# EAGLE design Franzininho_CNC (EAGLE 7.5.0)
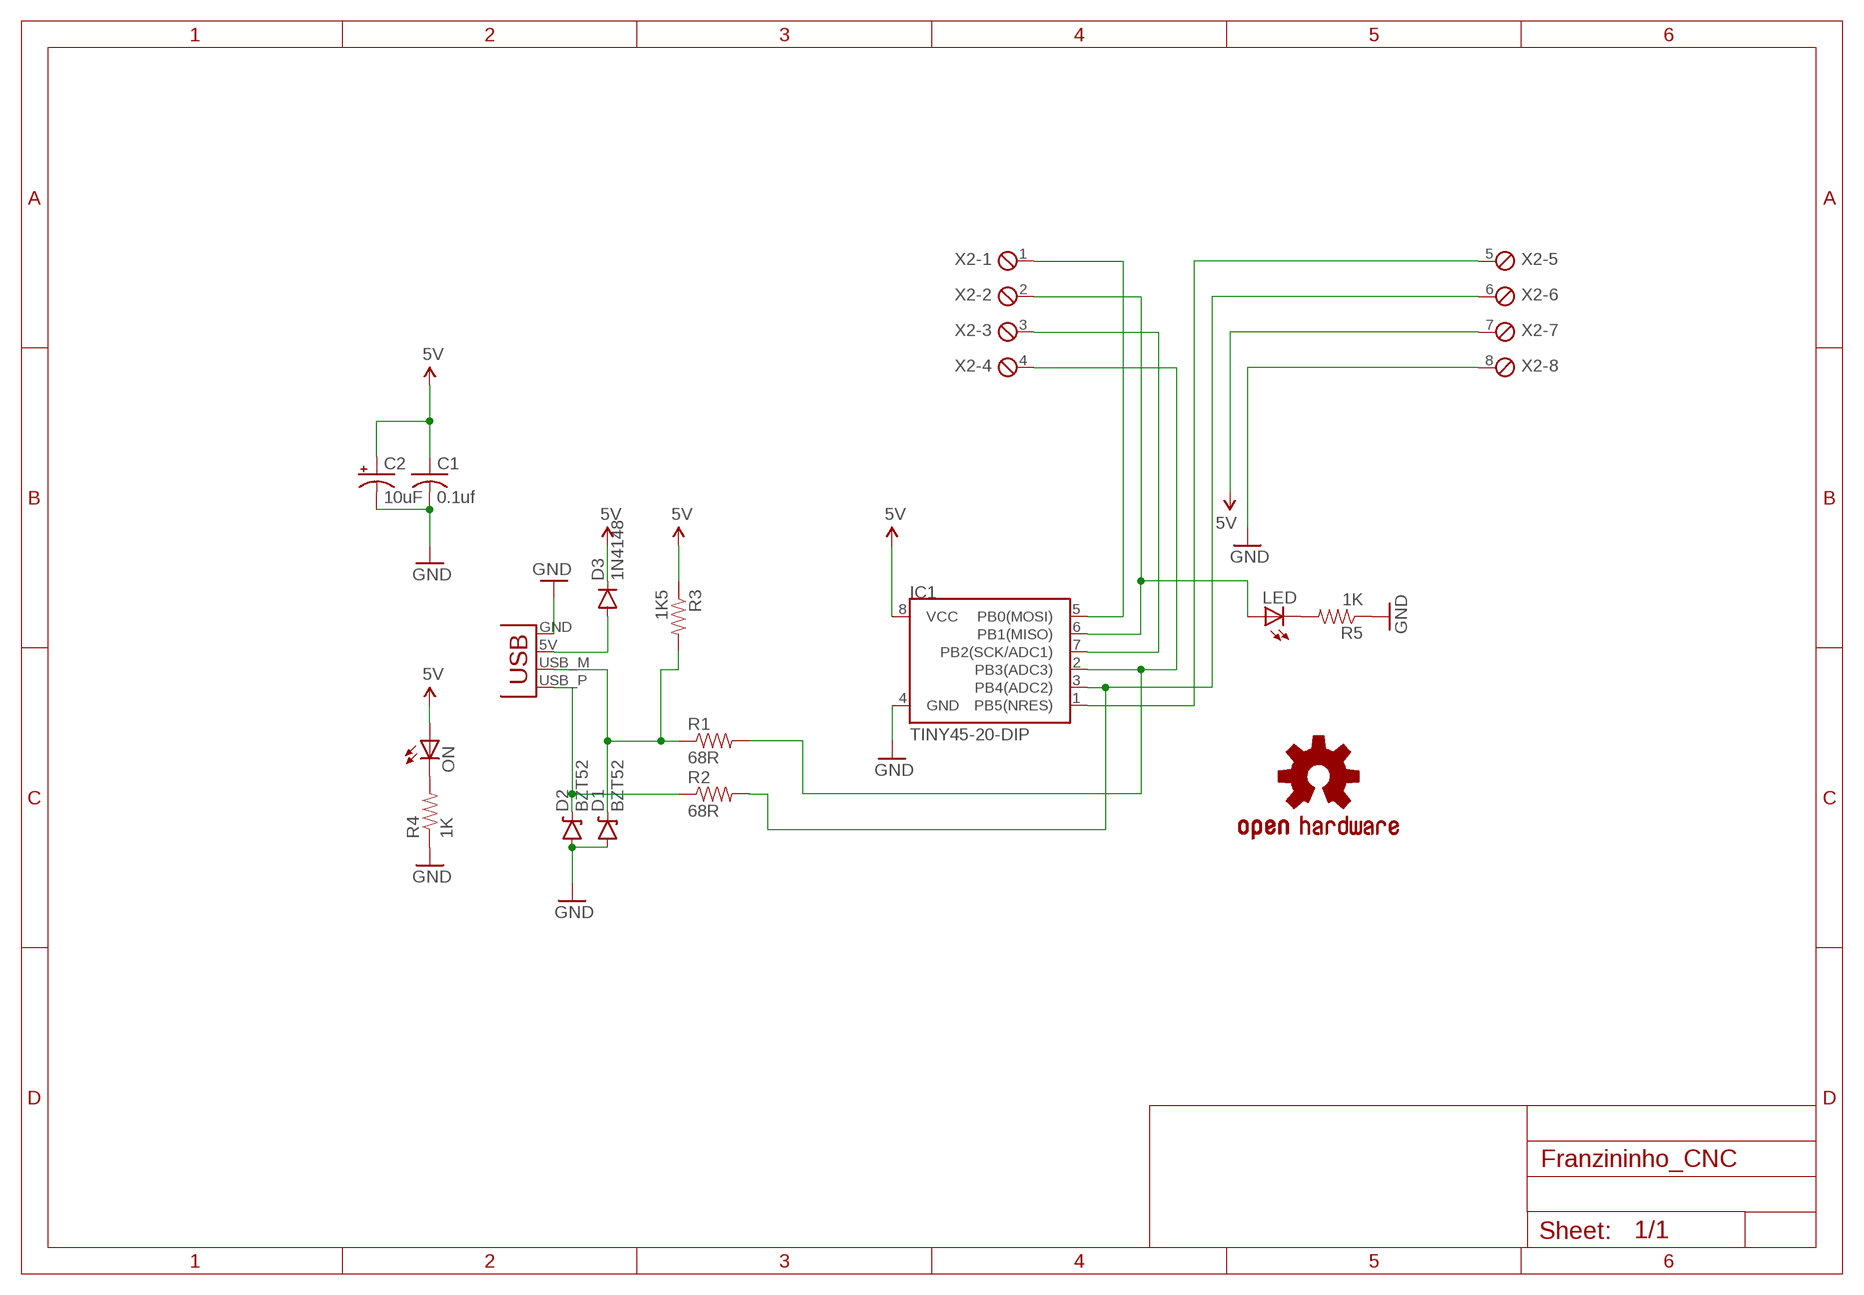
[diagram p0: schematic, sheet 1]

## Parts
C1  0.1uf  C-US025-025X050  [C025-025X050]
C2  10uF  CPOL-USE2,5-6E  [E2,5-6E]
D1  BZT52  DIODE-ZENER  [DIODE-BZT52]
D2  BZT52  DIODE-ZENER  [DIODE-BZT52]
D3  1N4148  DIODE1N4148  [DIODE-1N4148]
IC1  TINY45-20-DIP  ATTINY45TINY45-20-DIP  [DIP08]
LED  LED3MM  [LED3MM]
LOGO1  OSHW-LOGOL  [OSHW-LOGO-L]
ON  LED3MM  [LED3MM]
R1  68R  RESISTORPTH-1/4W  [AXIAL-0.4]
R2  68R  RESISTORPTH-1/4W  [AXIAL-0.4]
R3  1K5  RESISTORPTH-1/4W  [AXIAL-0.4]
R4  1K  RESISTORPTH-1/4W  [AXIAL-0.4]
R5  1K  RESISTORPTH-1/4W  [AXIAL-0.4]
X1  USBPCB  [USB-A-PCB]
X2  MPT8  [8POL254]

## Nets
5V: C1.1 C2.+ D3.C IC1.8(VCC) ON.A R3.P$1 X2.7
GND: C1.2 C2.- D1.A D2.A IC1.4(GND) R4.P$1 R5.P$1 X1.GND X2.8
N$1: IC1.2(PB3(ADC3)) R1.P$2 X2.4
N$2: IC1.6(PB1(MISO)) LED.A X2.2
N$3: IC1.5(PB0(MOSI)) X2.1
N$4: D3.A X1.5V(VBUS)
N$5: IC1.7(PB2(SCK/ADC1)) X2.3
N$6: IC1.3(PB4(ADC2)) R2.P$2 X2.6
N$8: IC1.1(PB5(NRES)) X2.5
N$10: D1.C R1.P$1 R3.P$2 X1.USB_M(D-)
N$11: D2.C R2.P$1 X1.USB_P(D+)
N$12: LED.K(C) R5.P$2
N$17: ON.K(C) R4.P$2

## Library data of the parts
C1 = adafruit:C-US: CAPACITOR, American symbol
C2 = adafruit:CPOL-US: POLARIZED CAPACITOR, American symbol
D1 D2 = SparkFun-DiscreteSemi:DIODE-ZENER: Zener Diode Production Part - 8199 3.4V Zener Voltage; PROD-ID: DIO-08199
D3 = SparkFun-DiscreteSemi:DIODE: Diode These are standard reverse protection diodes and small signal diodes. SMA package can handle up to about 1A. SOD-323 can handle about 200mA. What the SOD-323 package when ordering, there are some mfgs out there that are 5-pin packages.; PROD_ID: DIO-08378
IC1 = SparkFun-DigitalIC:ATTINY45: Atmel 8-pin 2/4/8kB flash uC; PROD_ID: IC-09439
LED ON = adafruit:LED: LED OSRAM: - CHIPLED LG R971, LG N971, LY N971, LG Q971, LY Q971, LO R971, LY R971 LH N974, LH R974 LS Q976, LO Q976, LY Q976 LO Q996 - Hyper CHIPLED LW Q18S LB Q993, LB Q99A, LB R99A - SideLED LS A670, LO A670, LY A670, LG A670, LP A670 LB A673, LV A673, LT A673, LW A673 LH A674 LY A675 LS A676, LA A676, LO A676, LY A676, LW A676 LS A679, LY A679, LG A679 - Hyper Micro SIDELED® LS Y876, LA Y876, LO Y876, LY Y876 LT Y87S - SmartLED LW L88C, LW L88S LB L89C, LB L89S, LG L890 LS L89K, LO L89K, LY L89K LS L896, LA L896, LO L896, LY L896 - TOPLED LS T670, LO T670, LY T670, LG T670, LP T670 LSG T670, LSP T670, LSY T670, LOP T670, LYG T670 LG T671, LOG T671, LSG T671 LB T673, LV T673, LT T673, LW T673 LH T674 LS T676, LA T676, LO T676, LY T676, LB T676, LH T676, LSB T676, LW T676 LB T67C, LV T67C, LT T67C, LS T67K, LO T67K, LY T67K, LW E67C LS E67B, LA E67B, LO E67B, LY E67B, LB E67C, LV E67C, LT E67C LW T67C LS T679, LY T679, LG T679 LS T770, LO T770, LY T770, LG T770, LP T770 LB T773, LV T773, LT T773, LW T773 LH T774 LS E675, LA E675, LY E675, LS T675 LS T776, LA T776, LO T776, LY T776, LB T776 LHGB T686 LT T68C, LB T68C - Hyper Mini TOPLED® LB M676 - Mini TOPLED Santana® LG M470 LS M47K, LO M47K, LY M47K Source: http://www.osram.convergy.de/
LOGO1 = SparkFun-Aesthetics:OSHW-LOGO: Open Source Hardware Logo This logo indicates the piece of hardware it is found on incorporates a OSHW license and/or adheres to the definition of open source hardware found here: http://freedomdefined.org/OSHW
R1-R5 = SparkFun-Passives:RESISTOR: Resistor Basic schematic elements and footprints for 0603, 1206, and PTH resistors.
X1 = SparkFun:USB: USB Connectors USB-B-PTH is fully proven SKU : PRT-00139 USB-miniB is fully proven SKU : PRT-00587 USB-A-PCB is untested. USB-A-H is throughly reviewed, but untested. Spark Fun Electronics SKU : PRT-00437 USB-B-SMT is throughly reviewed, but untested. Needs silkscreen touching up. USB-A-S has not been used/tested USB-MB-H has not been used/tested
X2 = con-phoenix-254:MPT8: PHOENIX CONNECTOR; OC_FARNELL: unknown; OC_NEWARK: unknown

## Board
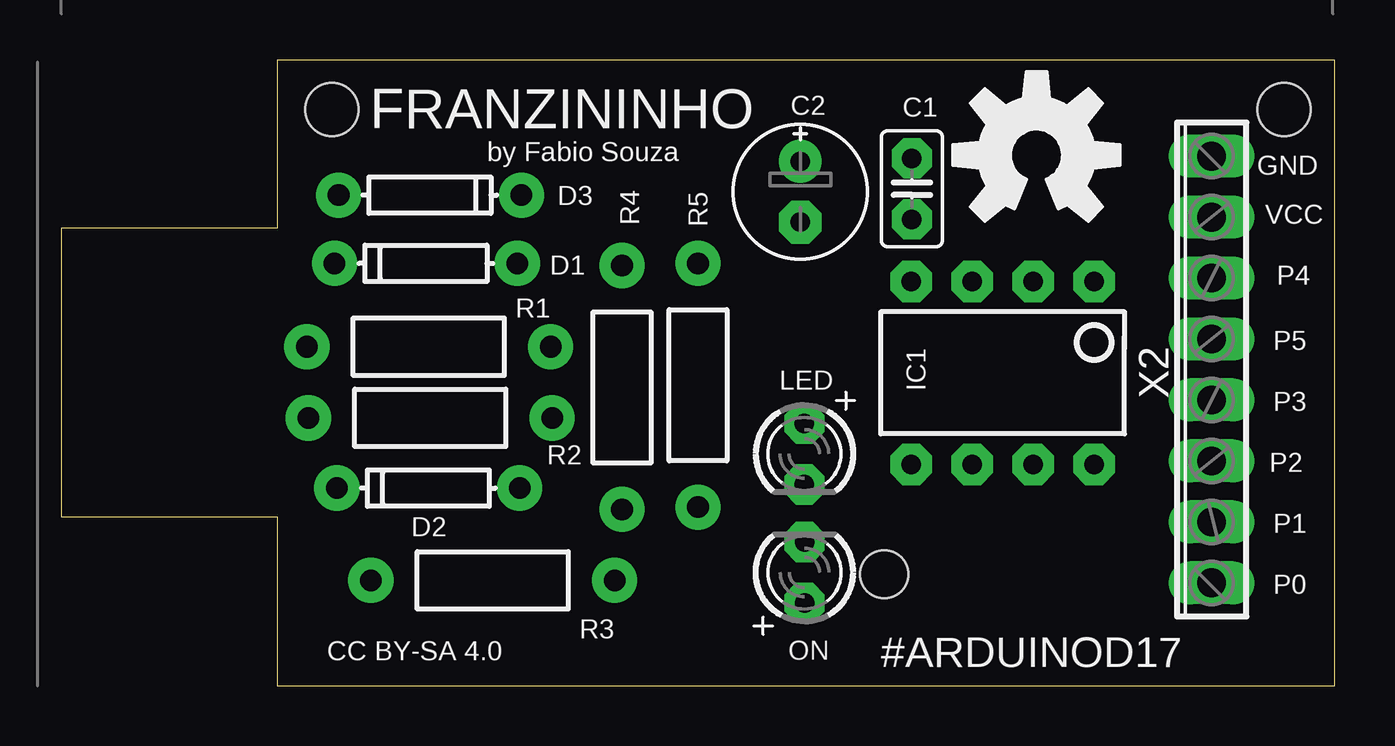
[diagram p1: board, top side]
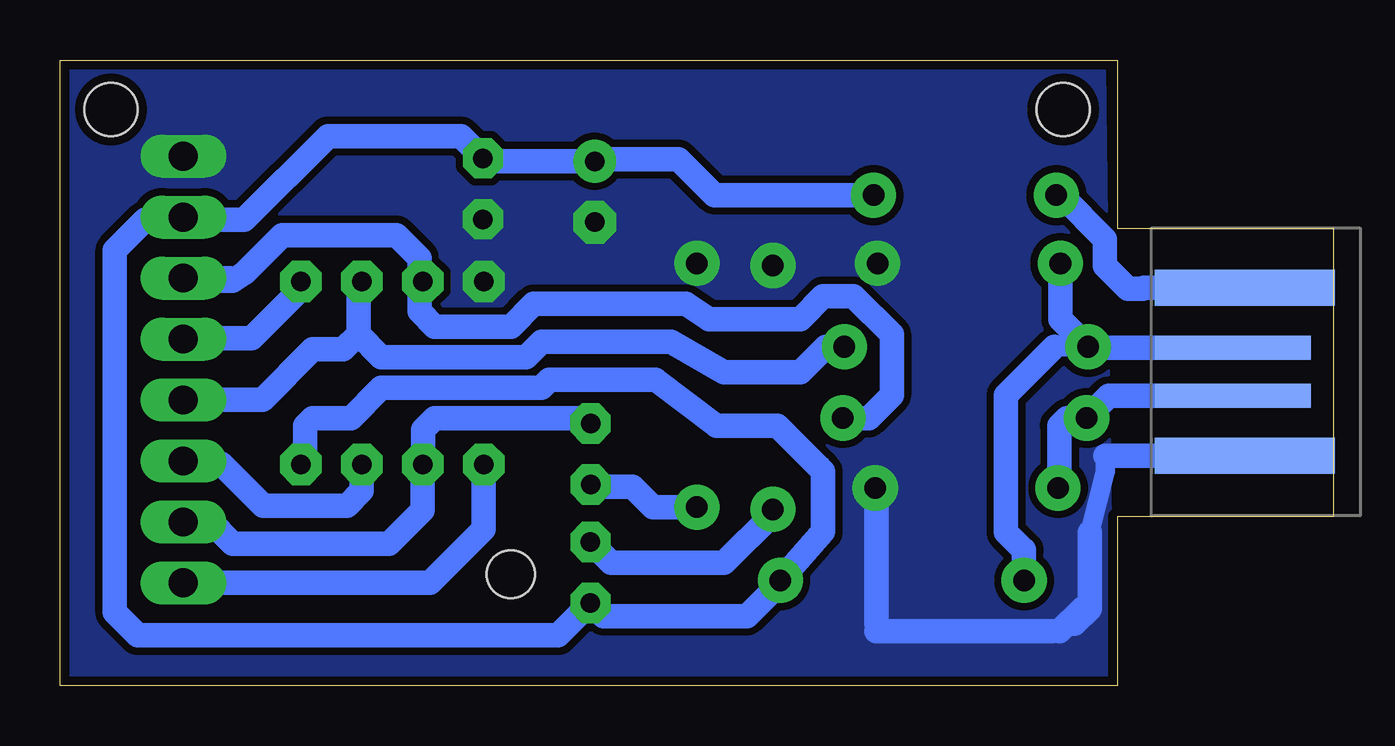
[diagram p2: board, bottom side, seen from below]

Size 53.08 x 26.08 mm. Coordinates in mm from the lower left corner, seen from the top.
Outline: 0,7.04 9,7.04 9,0 53.08,0 53.08,26.08 9,26.08 9,19.07 0,19.07 0,7.04
Copper layers (1*16): Top 0.0356mm / dielectric 1.5011mm / Bottom 0.0356mm
Design rules "default *": minimum track width 8mil, minimum drill 13mil, track to track 12mil, track to pad 12mil, pad to pad 12mil, via to via 12mil, smd to smd 8mil, copper to edge 15mil, drill to drill 15mil, minimum pad ring 7mil, minimum via ring 7mil, stop-mask expansion 4mil, vias tented up to drill 25mil, thermal gap 10mil
Holes 2.2 mm at 11.27,24.02 50.96,24.02
Holes 2 mm at 34.29,4.65

### Footprints (pad centres in the part's own frame; a part is rotated, then mirrored left to right if it is on the bottom)
C025-025X050 = drill 0.813 pad 1.676 octagon: 1 -1.27,0; 2 1.27,0
E2,5-6E = drill 0.813 pad 1.778: + -1.27,0 | drill 0.813 pad 1.778 octagon: - 1.27,0
DIODE-BZT52 = drill 0.9 pad 1.88: A -3.81,0; C 3.81,0
DIODE-1N4148 = drill 0.9 pad 1.88: A -3.81,0; C 3.81,0
DIP08 = drill 0.813 pad 1.727 octagon: 1 -3.81,-3.81; 2 -1.27,-3.81; 3 1.27,-3.81; 4 3.81,-3.81; 5 3.81,3.81; 6 1.27,3.81; 7 -1.27,3.81; 8 -3.81,3.81
LED3MM = drill 0.813 pad 1.676 octagon: A -1.27,0; K 1.27,0
AXIAL-0.4 = drill 0.9 pad 1.88: P$1 -5.08,0; P$2 5.08,0
USB-A-PCB = smd 7.5 x 1.5: 5V -0.2,-3.5; GND -0.2,3.5 | smd 6.5 x 1: USB_M 0.3,-1; USB_P 0.3,1
8POL254 = drill 1.2 long: 1 -8.89,0; 2 -6.35,0; 3 -3.81,0; 4 -1.27,0; 5 1.27,0; 6 3.81,0; 7 6.35,0; 8 8.89,0

### Placement (x,y rotation side)
C1  35.45,20.71 270 top
C2  30.8,20.59 270 top
D1  15.19,17.61 180 top
D2  15.29,8.24 180 top
D3  15.36,20.45 0 top
IC1  39.23,13.04 180 top
LED  30.97,9.67 270 top
LOGO1  40.64,22.11 0 top
ON  30.97,4.73 90 top
R1  15.31,14.13 0 top
R2  15.37,11.17 0 top
R3  17.98,4.39 180 top
R4  23.37,12.44 270 top
R5  26.53,12.53 270 top
X1  3.89,13.09 180 bottom
X2  47.94,13.18 90 top

### Tracks (layer width: path | path; a pad name or v marks a point on that pad's centre or on a via)
5V
  Bottom 0.406: D3.C 19.13,20.45 19.05,20.37
  Bottom 0.61: 21.27,9.26 21.27,8.94
  Bottom 0.813: 30.7,21.95 C2.+ | 35.33,21.86 C1.1 | 42.86,9.41 IC1.8 | R3.P$1 23.06,4.3 | 30.42,2.91 ON.A
  Bottom 1.016: R3.P$1 21.27,6.42 21.27,8.94 23.18,10.84 25.72,10.84 28.26,12.75 32.7,12.75 33.02,12.43 39.69,12.43 40.96,11.16 42.55,11.16 42.86,10.84 42.86,9.41 | D3.C 25.8,20.45 27.3,21.95 30.7,21.95 | C2.+ 35.33,21.86 | C1.1 36.37,22.91 41.91,22.91 45.4,19.41 48.06,19.41 | 23.06,4.3 24.45,2.91 30.42,2.91 | 48.06,19.41 49.53,19.41 50.8,18.14 50.8,3.06 49.85,2.11 32.32,2.11 ON.A | 48.06,19.41 X2.7
GND
  Bottom 0.406: 19.05,2.27 19.05,2.59 | 19.05,8.19 D2.A
  Bottom 0.813: 9.51,9.59 9.51,8.96 10.16,6.4
  Bottom 1.016: X1.GND 9.51,9.59 | 11.75,2.27 19.05,2.27 | 19.05,2.59 19.05,8.19 | 10.16,6.4 10.16,3.22 | 10.79,2.59 10.16,3.22 | 10.16,3.22 10.48,3.22 11.43,2.27
  pour Bottom (isolate 0.305, rank 6, no thermals): 9.53,25.77 52.86,25.77 52.86,0.21 9.21,0.36
N$1
  Bottom 0.813: 40.64,16.71 IC1.2
  Bottom 1.016: 40.64,14.65 39.69,13.7 33.66,13.7 33.02,14.34 27.62,14.34 25.4,13.06 22.23,13.06 21.16,14.13 R1.P$2 | 40.64,14.65 40.64,16.71 | 40.64,14.65 41.27,14.02 42.55,14.02 44.65,11.92 X2.4 47.93,11.91
N$2
  Bottom 0.406: 37.94,9.25 IC1.6
  Bottom 1.016: 37.94,9.25 37.94,10.68 37.47,11.16 31.19,11.16 LED.A | IC1.6 37.96,7.33 39.37,5.92 45.88,5.92 46.83,6.87 46.99,6.87 | 46.99,6.87 47.89,6.87 | 47.93,6.83 X2.2 47.03,6.83 46.99,6.87
N$3
  Bottom 1.016: IC1.5 35.42,6.54 37.66,4.3 X2.1
N$4
  Bottom 0.813: D3.A 11.35,20.45 | 5.87,16.4 6.03,16.56 7.94,16.56 7.91,16.59
  Bottom 1.016: 11.35,20.45 9.53,18.62 9.53,17.51 8.57,16.56 7.94,16.56 | X1.5V 7.91,16.59
N$5
  Bottom 1.016: IC1.7 40.5,8.12 41.12,7.51 44.61,7.51 46.35,9.26 46.59,9.26 | 46.59,9.26 46.91,9.26 | 47.93,9.37 X2.3 46.59,9.37 46.59,9.26 | 47.8,9.26 46.91,9.26 | 46.91,9.26 46.91,9.29
N$6
  Bottom 0.61: R2.P$2
  Bottom 1.016: 38.1,16.71 IC1.3 | 38.1,16.71 38.1,17.83 39.05,18.78 43.81,18.78 45.4,17.19 45.88,16.88 | 45.88,16.88 47.8,16.88 | R2.P$2 19.37,11.16 18.41,12.11 18.41,14.65 20,16.24 21.27,16.24 22.23,15.29 26.04,15.29 26.99,15.92 33.34,15.92 34.29,14.97 37.47,14.97 38.1,15.61 38.1,16.71 | X2.6 46,16.99 45.88,16.88
N$8
  Bottom 1.016: IC1.1 43.04,16.54 45.09,14.49 47.9,14.49 X2.5
N$10
  Bottom 0.406: 10.19,14.09 R1.P$1 | 13.02,5.76 12.99,5.76 12.9,5.67
  Bottom 0.813: R1.P$1 11.63,14.13
  Bottom 1.016: X1.USB_M 10.19,14.09 | D1.C 11.38,15.29 R1.P$1 | 11.63,14.13 13.65,12.11 13.65,6.4 13.02,5.76 | R3.P$2 12.9,5.67
N$11
  Bottom 0.61: R2.P$1 10.29,11.03 | 11.43,8.3 D2.C
  Bottom 1.016: X1.USB_P 9.37,12.09 R2.P$1 11.11,11.16 11.43,10.84 11.43,8.3
N$12
  Bottom 0.813: 30.87,8.3 LED.K
  Bottom 1.016: R5.P$2 28.36,7.45 29.21,8.3 30.87,8.3
N$17
  Bottom 0.406: R4.P$2 23.37,7.16
  Bottom 1.016: 23.37,7.16 25.4,5.13 30.1,5.13 ON.K

### Text on the board
tNames: FRANZININHO | by Fabio Souza | GND | VCC | P4 | P5 | P3 | P2 | P1 | P0 | #ARDUINOD17 | CC BY-SA 4.0